# EAGLE design NixiePower (EAGLE 7.1.0)
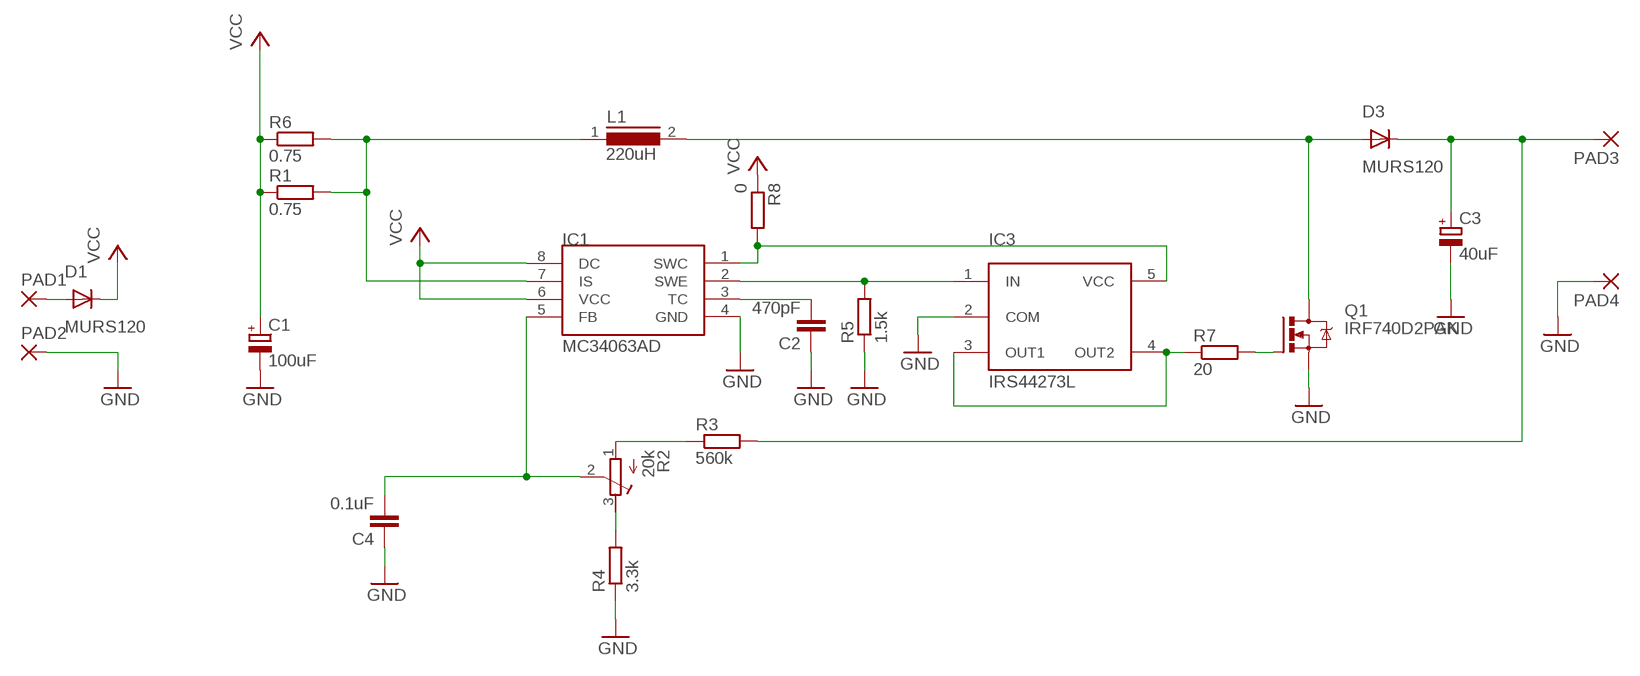
[diagram p0: schematic, sheet 1]

## Parts
C1  100uF  CPOL-EUD/7343-31R  [D/7343-31R]
C2  470pF  C-EUC1206K  [C1206K]
C3  40uF  CPOL-EUC/6032-28R  [C/6032-28R]
C4  0.1uF  C-EUC1206K  [C1206K]
D1  MURS120  DIODE-DO214AA  [DO214AA]
D3  MURS120  DIODE-DO214AA  [DO214AA]
IC1  MC34063AD  [SOIC8]
IC3  IRS44273L  [SOT23-5]
L1  220uH  DR125  [DR125]
PAD1  SMD5  [SMD2,54-5,08]
PAD2  SMD5  [SMD2,54-5,08]
PAD3  SMD5  [SMD2,54-5,08]
PAD4  SMD5  [SMD2,54-5,08]
Q1  IRF740D2PAK  [D2PAK]
R1  0.75  R-EU_R1206  [R1206]
R2  20k  R-TRIMM4G/J  [RTRIM4G/J]
R3  560k  R-EU_R1206  [R1206]
R4  3.3k  R-EU_R1206  [R1206]
R5  1.5k  R-EU_R1206  [R1206]
R6  0.75  R-EU_R1206  [R1206]
R7  20  R-EU_R1206  [R1206]
R8  0  R-EU_R1206  [R1206]

## Nets
GND: C1.- C2.1 C3.- C4.1 IC1.4(GND) IC3.2(COM) PAD2.1(P) PAD4.1(P) Q1.3(S) R4.1 R5.1
N$1: D3.A L1.2 Q1.4(D)
N$2: C2.2 IC1.3(TC)
N$3: IC1.7(IS) L1.1 R1.2 R6.2
N$4: IC1.1(SWC) IC3.5(VCC) R8.2
N$5: Q1.1(G) R7.2
N$6: C3.+ D3.C PAD3.1(P) R3.2
N$7: C4.2 IC1.5(FB) R2.2(S)
N$8: IC3.3(OUT1) IC3.4(OUT2) R7.1
N$9: R2.1(A) R3.1
N$10: R2.3(E) R4.2
N$11: IC1.2(SWE) IC3.1(IN) R5.2
N$12: D1.A PAD1.1(P)
VCC: C1.+ D1.C IC1.6(VCC) IC1.8(DC) R1.1 R6.1 R8.1

## Library data of the parts
C1 C3 = rcl:CPOL-EU: POLARIZED CAPACITOR, European symbol
C2 C4 = rcl:C-EU: CAPACITOR, European symbol
D1 D3 = diode:DIODE-: DIODE
IC1 = mc34063:MC34063
IC3 = own-collection:IRS44273L: Single Low-Side Driver IC
L1 = inductors:DR125: High Power Density, High Efficiency, Shielded Inductors Source: coiltronics_dr_series.pdf
PAD1-PAD4 = wirepad:SMD5: SMD PAD
Q1 = own-collection:IRF740: N-CHANNEL MOS FET
R1 R3-R8 = rcl-2:R-EU_: RESISTOR, European symbol
R2 = rcl:R-TRIMM: Trimm resistor

## Board
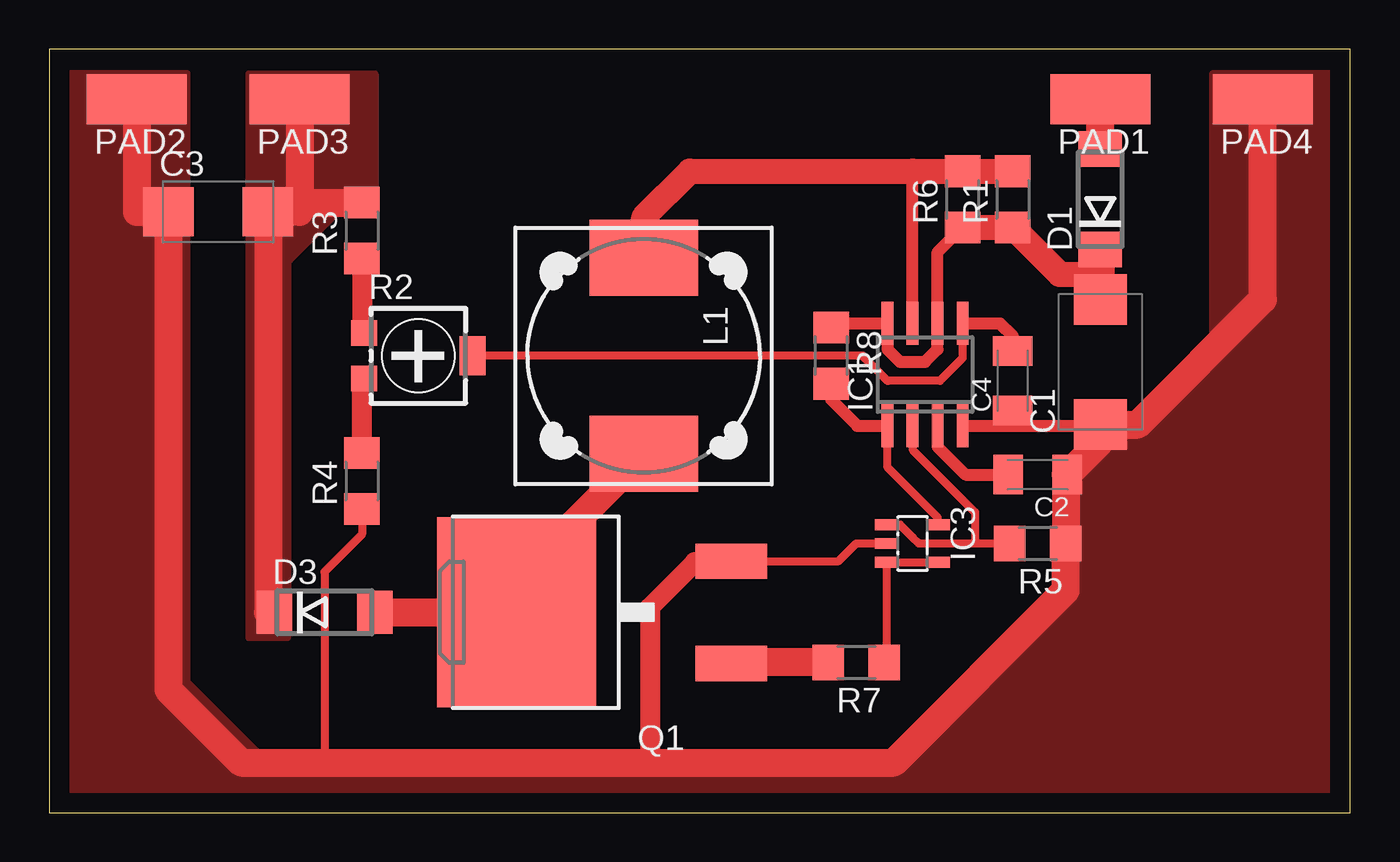
[diagram p1: board, top side]

Size 66.03 x 38.73 mm. Coordinates in mm from the lower left corner, seen from the top.
Outline: 0,0 66.03,0 66.03,38.73 0,38.73 0,0
Copper layers (1*16): Top 0.035mm / dielectric 1.5mm / Bottom 0.035mm
Design rules "default": minimum track width 10mil, minimum drill 24mil, track to track 8mil, track to pad 8mil, pad to pad 8mil, via to via 8mil, smd to smd 8mil, copper to edge 40mil, drill to drill 8mil, minimum pad ring 10mil, minimum via ring 8mil, stop-mask expansion 4mil, vias tented up to drill 0mil, thermal gap 10mil

### Footprints (pad centres in the part's own frame; a part is rotated, then mirrored left to right if it is on the bottom)
D/7343-31R = smd 2.55 x 2.7: + 3.175,0; - -3.175,0
C1206K = smd 1.5 x 2: 1 -1.5,0; 2 1.5,0
C/6032-28R = smd 2.55 x 2.5: + 2.525,0; - -2.525,0
DO214AA = smd 1.8 x 2.2: A 2.55,0; C -2.55,0
SOIC8 = smd 0.6 x 2.2: 1 -1.905,-2.6; 2 -0.635,-2.6; 3 0.635,-2.6; 4 1.905,-2.6; 5 1.905,2.6; 6 0.635,2.6; 7 -0.635,2.6; 8 -1.905,2.6
SOT23-5 = smd 0.55 x 1.2: 1 -0.95,-1.3; 2 0,-1.3; 3 0.95,-1.3; 4 0.95,1.3; 5 -0.95,1.3
DR125 = smd 3.85 x 5.5: 1 -4.975,0; 2 4.975,0
SMD2,54-5,08 = smd 2.54 x 5.08: 1 0,0
D2PAK = smd 1.78 x 3.635: 1 -2.598,-5.31; 3 2.598,-5.31 | smd 9.652 x 8.066: 4 0,5.588
R1206 = smd 1.6 x 1.803: 1 -1.422,0; 2 1.422,0
RTRIM4G/J = smd 1.3 x 1.3: 1 -1.15,-2.75; 3 1.15,-2.75 | smd 2 x 1.3: 2 0,2.75

### Placement (x,y rotation side)
C1  53.34,22.86 90 top
C2  50.16,17.14 180 top
C3  8.57,30.48 0 top
C4  48.9,21.91 90 top
D1  53.34,31.11 90 top
D3  13.97,10.16 0 top
IC1  44.45,22.23 0 top
IC3  43.81,13.65 270 top
L1  30.16,23.18 270 top
PAD1  53.34,36.2 90 top
PAD2  4.45,36.2 90 top
PAD3  12.7,36.2 90 top
PAD4  61.59,36.2 90 top
Q1  29.3,10.16 90 top
R1  48.9,31.11 90 top
R2  18.73,23.18 270 top
R3  15.88,29.53 90 top
R4  15.88,16.83 90 top
R5  50.16,13.65 180 top
R6  46.35,31.11 90 top
R7  40.96,7.62 180 top
R8  39.69,23.18 270 top

### Tracks (layer width: path | path; a pad name or v marks a point on that pad's centre or on a via)
GND
  Top 0.406: 53.34,19.62 C1.- | C2.1 51.59,17.14 | IC3.2 40.96,13.65 40.06,12.76 Q1.3 35.24,12.7 | R4.1 15.88,14.12 13.97,12.21 13.97,2.54
  Top 0.61: IC1.4 48.9,19.62 | 48.9,19.62 53.34,19.62 | C4.1 48.9,19.62
  Top 1.016: 35.24,12.7 32.77,12.7 30.48,10.41 30.48,2.54
  Top 1.422: PAD4.1 61.59,26.04 55.24,19.68 C1.- 53.34,18.82 C2.1 | 51.59,17.14 R5.1 51.59,11.27 42.86,2.54 30.48,2.54 13.97,2.54 9.75,2.54 6.05,6.24 C3.- 4.45,30.48 PAD2.1
  pour Top (no thermals): 66.04,37.47 59.05,37.47 59.05,24.13 51.44,16.51 51.44,11.43 42.55,2.54 11.05,2.54 6.99,6.61 6.99,37.47 0,37.47 0,0 66.04,0
N$1
  Top 1.422: D3.A Q1.4 23.71,11.75 L1.2
N$2
  Top 0.61: IC1.3 45.09,18.57 46.51,17.14 C2.2
N$3
  Top 0.61: IC1.7 43.81,32.54
  Top 1.27: L1.1 30.16,30.19 32.51,32.54 43.81,32.54 R6.2 R1.2
N$4
  Top 0.406: IC3.5 45.09,14.6 45.09,14.98 42.55,17.52 IC1.1
  Top 0.61: R8.2 39.69,20.95 41.01,19.62 IC1.1
N$5
  Top 0.406: 35.24,7.62 Q1.1
  Top 1.422: R7.2 35.24,7.62
N$6
  Top 0.406: 11.1,10.16 D3.C
  Top 1.422: C3.+ 11.1,30.63 | C3.+ 11.1,10.16 | PAD3.1 12.7,30.95 | 12.7,30.95 12.7,30.48 C3.+ | 12.7,30.95 R3.2
  pour Top (no thermals): 12.06,8.89 10.16,8.89 10.16,37.47 16.51,37.47 16.51,30.48 14.61,30.48 12.06,27.94
N$7
  Top 0.406: IC1.5 46.35,23.05 45.21,21.91 42.55,21.91 41.27,23.18 R2.2
  Top 0.61: IC1.5 48.26,24.82 48.9,24.19 C4.2
N$8
  Top 0.406: IC3.4 IC3.3 42.52,7.3 R7.1
N$9
  Top 0.406: 15.88,24.33 R2.1
  Top 1.016: R3.1 15.88,24.33
N$10
  Top 0.406: 15.88,22.03 R2.3
  Top 1.016: R4.2 15.88,22.03
N$11
  Top 0.406: IC3.1 43.18,14.6 43.81,13.97 44.13,13.65 46.99,13.65 | 46.99,13.65 R5.2 | IC1.2 43.81,18.41 46.99,15.24 46.99,13.65
N$12
  Top 1.422: D1.A PAD1.1
VCC
  Top 0.406: R8.1 39.69,24.84
  Top 0.61: R6.1 45.09,28.42 IC1.6 45.09,23.5 44.45,22.86 43.18,22.86 42.55,23.5 IC1.8 40.95,24.82 39.69,24.84
  Top 1.27: R6.1 R1.1 51.28,27.3 53.34,27.3
  Top 1.422: D1.C 53.34,27.3 C1.+